# Altium schematic sheet bq25157_Battery_Charger.SchDoc: BQ25157 Battery Charger
size A4; DocumentNumber: 14; SheetNumber: 14; SheetTotal: 31
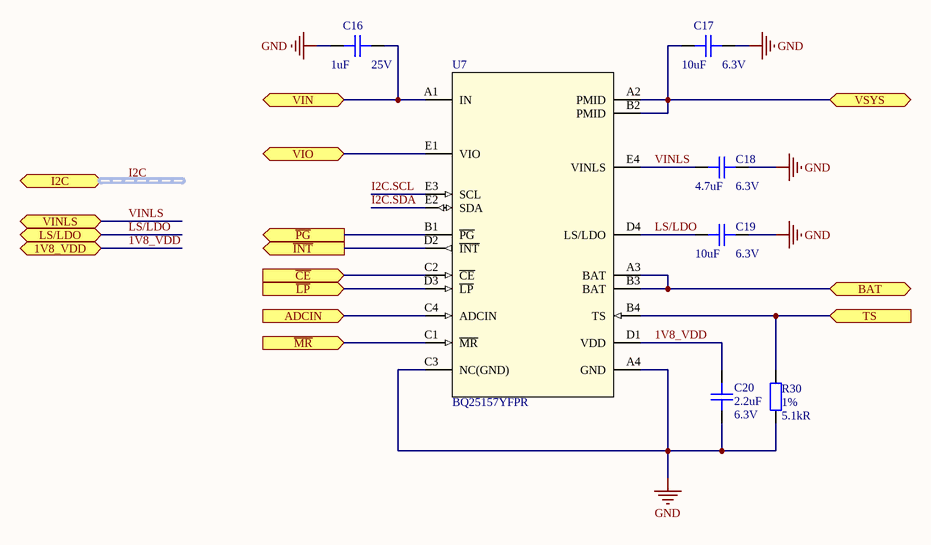
[diagram p0: bq25157_Battery_Charger.SchDoc]

## Parts
C16  Capacitance: 1uF  Voltage Rating: 25V  [CAP_0603]  (hidden comment: CAP CER 1UF 25V X5R 0603)
C17  Capacitance: 10uF  Voltage Rating: 6.3V  [C0402]  (hidden comment: CAP CER 10UF 6.3V X5R 0402)
C18  Capacitance: 4.7uF  Voltage Rating: 6.3V  [C0402]  (hidden comment: CAP CER 4.7UF 6.3V X5R 0402)
C19  Capacitance: 10uF  Voltage Rating: 6.3V  [C0402]  (hidden comment: CAP CER 10UF 6.3V X5R 0402)
C20  Capacitance: 2.2uF  Voltage: 6.3V  [C0402]  (hidden comment: CAP CER 2.2UF 6.3V X5R 0402)
R30  Tolerance: 1%  Resistance: 5.1kR  [R0402]  (hidden comment: RES SMD 5.1K OHM 1% 1/16W 0402)
U7  BQ25157YFPR  [YFP0020]

## Ports
1V8_VDD, ADCIN (in), BAT, I2C (harness I2C), LS/LDO, TS (in), VIN, VINLS, VIO, VSYS, ~{CE} (in), ~{INT} (out), ~{LP} (in), ~{MR} (in), ~{PG} (out)

## Nets
GND: C16.1 C17.2 C18.2 C19.2 C20.1 R30.1 U7.A4(GND) U7.C3(NC(GND))
1V8_VDD: C20.2 U7.D1(VDD) ; port 1V8_VDD
~{CE}: U7.C2(~{CE}) ; port ~{CE}
~{INT}: U7.D2(~{INT}) ; port ~{INT}
~{LP}: U7.D3(~{LP}) ; port ~{LP}
~{MR}: U7.C1(~{MR}) ; port ~{MR}
~{PG}: U7.B1(~{PG}) ; port ~{PG}
ADCIN: U7.C4(ADCIN) ; port ADCIN
BAT: U7.A3(BAT) U7.B3(BAT) ; port BAT
I2C.SCL: U7.E3(SCL)
I2C.SDA: U7.E2(SDA)
LS/LDO: C19.1 U7.D4(LS/LDO) ; port LS/LDO
TS: R30.2 U7.B4(TS) ; port TS
VIN: C16.2 U7.A1(IN) ; port VIN
VINLS: C18.1 U7.E4(VINLS) ; port VINLS
VIO: U7.E1(VIO) ; port VIO
VSYS: C17.1 U7.A2(PMID) U7.B2(PMID) ; port VSYS

## Buses and harness runs
harness I2C = port I2C

## Notes on the sheet
- Title
- Size:
- Date:
- A4
- Number:
- Time:
- Revision:
- Sheet
- of
- File:

## Library data of the parts
C16 = CAP CER 1UF 25V X5R 0603: 1µF ±20% 25V Ceramic Capacitor X5R 0603 (1608 Metric); Manufacturer: Yageo; Manufacturer Part Number: CC0603MRX5R8BB105; Supplier 1: Digi-Key; Stock 1: 31570; Pricing 1: 1=0.13, 10=0.093, 50=0.0528, 100=0.0438, 500=0.0307, 1000=0.0254 (USD); Mount: Surface Mount; Case Code (Imperial): 0603; Case Code (Metric): 1608; Min Operating Temperature: -55°C; Max Operating Temperature: 85°C; Tolerance: 20%; Packaging: Tape and Reel; Voltage Rating (DC): 25V; Dielectric: X5R; Length: 0.063inch; Width: 0.031inch; Thickness: 0.035inch; Lead Free: Lead Free; ComponentLink1URL: http://www.yageo.com/exep/pages/download/literatures/ProductSelectionGuide%202014_Final_2.pdf?src-supplier=Digi-Key; ComponentLink1Description: http://www.yageo.com/exep/pages/download/literatures/ProductSelectionGuide%202014_Final_2.pdf?src-supplier=Digi-Key; Supplier Part Number 1: 311-1823-1-ND; Case/Package: 0603; ComponentLink2URL: http://www.yageo.com/documents/recent/UPY-GPHC_X5R_4V-to-50V_25.pdf?src-supplier=Digi-Key; ComponentLink2Description: http://www.yageo.com/documents/recent/UPY-GPHC_X5R_4V-to-50V_25.pdf?src-supplier=Digi-Key; Halogen Free: Halogen Free
C17 C19 = CAP CER 10UF 6.3V X5R 0402: 10µF ±20% 6.3V Ceramic Capacitor X5R 0402 (1005 Metric); Manufacturer: Samsung; Manufacturer Part Number: CL05A106MQ5NUNC; Supplier 1: Digi-Key; Stock 1: 1544395; Pricing 1: 1=0.27, 10=0.187, 50=0.1248, 100=0.1061, 500=0.0749, 1000=0.0655, 2500=0.0624, 5000=0.0577 (USD); Mount: Surface Mount; Case/Package: 0402; Case Code (Metric): 1005; Case Code (Imperial): 0402; Min Operating Temperature: -55°C; Max Operating Temperature: 85°C; Tolerance: 20%; Dielectric: X5R; Packaging: Tape and Reel; Package Quantity: 1; Series: CL; Construction: Flat; Length: 1mm; Width: 0.02inch; Height: 0.5mm; Thickness: 0.028inch; Depth: 0.5mm; Radiation Hardening: No; ComponentLink1URL: https://www.verical.com/server-webapp/html/getDatasheet?partID=355289&src-supplier=Verical; ComponentLink1Description: https://www.verical.com/server-webapp/html/getDatasheet?partID=355289&src-supplier=Verical; ComponentLink2URL: http://www1.futureelectronics.com/doc/SAMSUNG/CL05A106MQ5NUNC.pdf?src-supplier=Future+Electronics; ComponentLink2Description: http://www1.futureelectronics.com/doc/SAMSUNG/CL05A106MQ5NUNC.pdf?src-supplier=Future+Electronics; Supplier Part Number 1: 1276-1451-1-ND
C18 = CAP CER 4.7UF 6.3V X5R 0402: 4.7µF ±20% 6.3V Ceramic Capacitor X5R 0402 (1005 Metric); Manufacturer: Samsung; Manufacturer Part Number: CL05A475MQ5NRNC; Supplier 1: Digi-Key; Stock 1: 746765; Pricing 1: 1=0.14, 10=0.099, 50=0.0564, 100=0.0467, 500=0.0327, 1000=0.0271, 2500=0.0252, 5000=0.0231 (USD); Mount: Surface Mount; Case/Package: 0402; Case Code (Metric): 1005; Case Code (Imperial): 0402; Min Operating Temperature: -55°C; Max Operating Temperature: 85°C; Tolerance: 20%; Packaging: Tape and Reel; Series: CL; Length: 0.039inch; Width: 0.02inch; Thickness: 0.022inch; RoHS Compliant: Yes; ComponentLink1URL: https://www.verical.com/server-webapp/html/getDatasheet?partID=359681&src-supplier=Verical; ComponentLink1Description: https://www.verical.com/server-webapp/html/getDatasheet?partID=359681&src-supplier=Verical; ComponentLink2URL: http://www1.futureelectronics.com/doc/SAMSUNG/CL05A475MQ5NRNC.pdf?src-supplier=Future+Electronics; ComponentLink2Description: http://www1.futureelectronics.com/doc/SAMSUNG/CL05A475MQ5NRNC.pdf?src-supplier=Future+Electronics; Supplier Part Number 1: 1276-1056-1-ND
C20 = CAP CER 2.2UF 6.3V X5R 0402: 2.2µF ±20% 6.3V Ceramic Capacitor X5R 0402 (1005 Metric); Manufacturer: Murata; Manufacturer Part Number: GRM155R60J225ME15D; Supplier 1: Digi-Key; Stock 1: 4444410; Pricing 1: 1=0.29, 10=0.199, 100=0.1009, 500=0.0691, 1000=0.0611, 2500=0.0584, 5000=0.0531 (USD); Mount: Surface Mount; Case/Package: 0402; Case Code (Metric): 1005; Material: Ceramic; Min Operating Temperature: -55°C; Max Operating Temperature: 85°C; Tolerance: 20%; Dielectric: X5R; Packaging: Tape and Reel; Package Quantity: 10000; Voltage Rating: 6.3V; Voltage Rating (DC): 6.3V; Termination: SMD/SMT; Length: 1mm; Height: 0.5mm; Width: 0.02inch; Thickness: 0.022inch; Depth: 0.5mm; Radiation Hardening: No; REACH SVHC: No SVHC; Lead Free: Lead Free; ComponentLink1URL: https://www.murata.com/~/media/webrenewal/support/library/catalog/products/capacitor/mlcc/c02e.ashx?la=en-us&src-supplier=Digi-Key; ComponentLink1Description: https://www.murata.com/~/media/webrenewal/support/library/catalog/products/capacitor/mlcc/c02e.ashx?la=en-us&src-supplier=Digi-Key; ComponentLink2URL: http://www.murata.com/~/media/webrenewal/support/library/catalog/products/capacitor/mlcc/c02e.ashx?src-supplier=Avnet; ComponentLink2Description: http://www.murata.com/~/media/webrenewal/support/library/catalog/products/capacitor/mlcc/c02e.ashx?src-supplier=Avnet; ComponentLink3URL: http://www.farnell.com/datasheets/2047859.pdf?src-supplier=Element14; ComponentLink3Description: http://www.farnell.com/datasheets/2047859.pdf?src-supplier=Element14; ComponentLink4URL: https://produktinfo.conrad.com/datenblaetter/450000-474999/450128-da-01-de-VS_KONDENS_GRM155_R60J_225ME15D.pdf?src-supplier=Conrad; ComponentLink4Description: https://produktinfo.conrad.com/datenblaetter/450000-474999/450128-da-01-de-VS_KONDENS_GRM155_R60J_225ME15D.pdf?src-supplier=Conrad; Supplier Part Number 1: 490-4519-1-ND; Case Code (Imperial): 0402
R30 = RES SMD 5.1K OHM 1% 1/16W 0402: 5.1 kOhms ±1% 0.063W, 1/16W Chip Resistor 0402 (1005 Metric) Moisture Resistant Thick Film; Manufacturer: Yageo; Manufacturer Part Number: RC0402FR-075K1L; Max Power Dissipation: 63mW; Temperature Coefficient: 100ppm/°C; Voltage Rating (DC): 50V; Supplier 1: Digi-Key; Stock 1: 19803; Pricing 1: 1=0.1, 10=0.016, 100=0.0064, 1000=0.0029, 2500=0.0025, 5000=0.0021 (USD); Case/Package: 0402; Case Code (Metric): 1005; Case Code (Imperial): 0402; Min Operating Temperature: -55°C; Max Operating Temperature: 155°C; Packaging: Tape and Reel; Composition: Thick Film; Number of Terminations: 2; Package Quantity: 1; Power Rating: 63mW; Military Standard: Not; Features: Moisture Resistant; Voltage Rating: 50V; Termination: SMD/SMT; Working Voltage: 50V; Length: 1mm; Height: 0.016inch; Width: 0.02inch; Depth: 0.5mm; Lead Free: Lead Free; REACH SVHC: Unknown; ComponentLink1URL: https://www.verical.com/server-webapp/html/getDatasheet?partID=323636&src-supplier=Verical; ComponentLink1Description: https://www.verical.com/server-webapp/html/getDatasheet?partID=323636&src-supplier=Verical; ComponentLink2URL: http://www.yageo.com/documents/recent/PYu-RC_Group_51_RoHS_L_10.pdf?src-supplier=Digi-Key; ComponentLink2Description: http://www.yageo.com/documents/recent/PYu-RC_Group_51_RoHS_L_10.pdf?src-supplier=Digi-Key; ComponentLink3URL: http://www.farnell.com/datasheets/2167052.pdf?src-supplier=Element14; ComponentLink3Description: http://www.farnell.com/datasheets/2167052.pdf?src-supplier=Element14; ComponentLink4URL: http://www.yageo.com/documents/recent/PYu-RC0402_51_RoHS_L_6_r.pdf?src-supplier=Future+Electronics; ComponentLink4Description: http://www.yageo.com/documents/recent/PYu-RC0402_51_RoHS_L_6_r.pdf?src-supplier=Future+Electronics; ComponentLink5URL: http://www.yageo.com/documents/recent/PYu-RC0402_51_RoHS_L_6_r.pdf?src-supplier=Mouser; ComponentLink5Description: http://www.yageo.com/documents/recent/PYu-RC0402_51_RoHS_L_6_r.pdf?src-supplier=Mouser; ComponentLink6URL: http://www.farnell.com/datasheets/1018594.pdf?src-supplier=Element14; ComponentLink6Description: http://www.farnell.com/datasheets/1018594.pdf?src-supplier=Element14; Supplier Part Number 1: 311-5.10KLRCT-ND
U7 = IC BQ25157YFPR BATT CHG LI-ION 1CELL 20DSBGA: Charger IC Lithium Ion/Polymer 20-DSBGA (2.02x1.62); Manufacturer: Texas Instruments; Supplier 1: Digi-Key; Manufacturer Part Number: BQ25157YFPR; Stock 1: 0; Pricing 1: 1=2.97, 10=2.664, 25=2.5184, 100=2.0708, 250=1.8581, 500=1.791, 1000=1.4888 (USD); ComponentLink1URL: https://octopart.com/click/track?ai=10049&ct=datasheets&sig=0484d06&at=physicalpart&sid=370&ppid=114161831&hlid=31393893&src-supplier=TI+store; ComponentLink1Description: https://octopart.com/click/track?ai=10049&ct=datasheets&sig=0484d06&at=physicalpart&sid=370&ppid=114161831&hlid=31393893&src-supplier=TI+store; Supplier Part Number 1: 296-BQ25157YFPRCT-ND